# Altium project LTC_on_COMP.PrjPcb
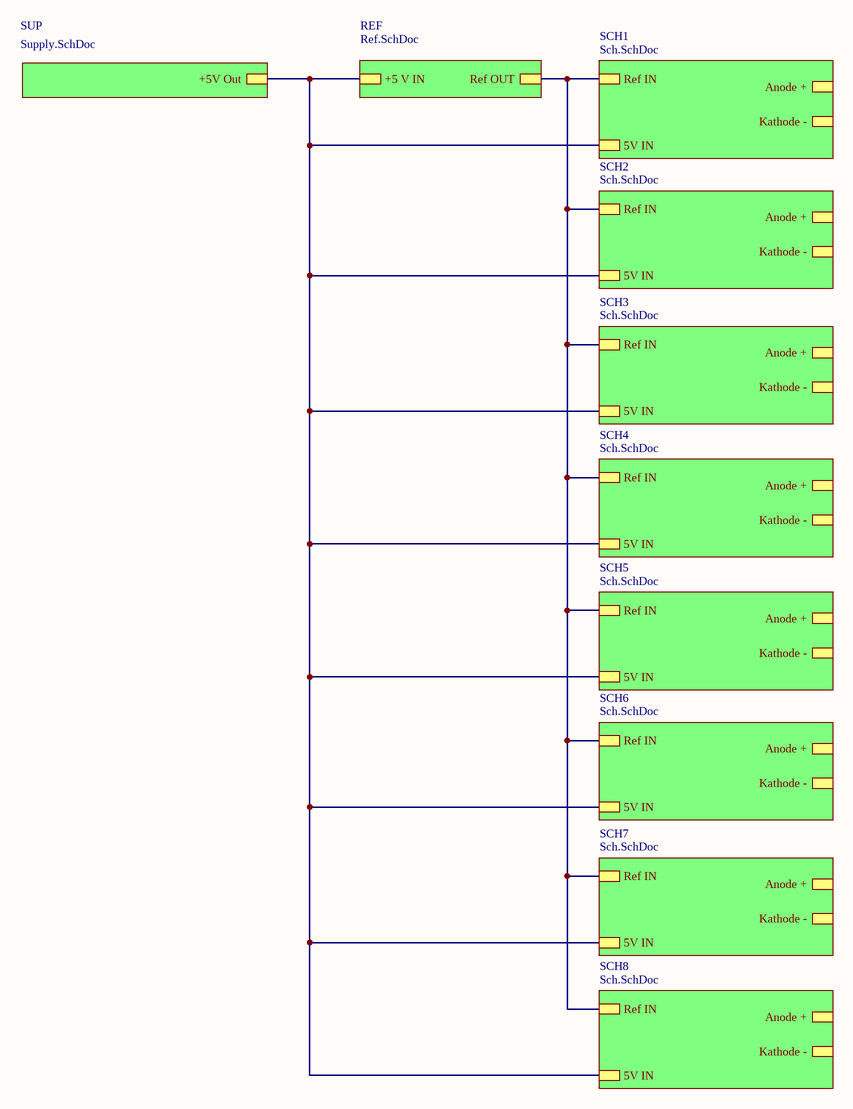
[diagram p0: Struct.SchDoc]
4 sheets, 77 parts. Net scope: hierarchical (ports join the sheet entries above them; power ports are global).
Board files: PCB1.PcbDoc, PCB2.PcbDoc
Sheets:
  Struct.SchDoc
    REF = Ref.SchDoc
    SUP = Supply.SchDoc
    SCH1 = Sch.SchDoc
    SCH2 = Sch.SchDoc
    SCH3 = Sch.SchDoc
    SCH4 = Sch.SchDoc
    SCH5 = Sch.SchDoc
    SCH6 = Sch.SchDoc
    SCH7 = Sch.SchDoc
    SCH8 = Sch.SchDoc

## Sheet Struct.SchDoc
size 420 x 297 mm; Address1: Address1; Address2: Address2; Address3: Address3; Address4: Address4; DocumentNumber: АБВГ.123456.001 Э3; SheetNumber: 1; Scale: 1:1; DocumentType: Схема электрическая принципиальная; FirstReferrence: АБВГ.123456.001

### Sub-sheets
REF = Ref.SchDoc: +5 V IN, Ref OUT
SCH1 = Sch.SchDoc: Ref IN, 5V IN, Anode +, Kathode -
SCH2 = Sch.SchDoc: Ref IN, 5V IN, Anode +, Kathode -
SCH3 = Sch.SchDoc: Ref IN, 5V IN, Anode +, Kathode -
SCH4 = Sch.SchDoc: Ref IN, 5V IN, Anode +, Kathode -
SCH5 = Sch.SchDoc: Ref IN, 5V IN, Anode +, Kathode -
SCH6 = Sch.SchDoc: Ref IN, 5V IN, Anode +, Kathode -
SCH7 = Sch.SchDoc: Ref IN, 5V IN, Anode +, Kathode -
SCH8 = Sch.SchDoc: Ref IN, 5V IN, Anode +, Kathode -
SUP = Supply.SchDoc: +5V Out

### Nets
NetC3#1_2: sheet REF/+5 V IN, sheet SUP/+5V Out, sheet SCH1/5V IN, sheet SCH2/5V IN, sheet SCH3/5V IN, sheet SCH4/5V IN, sheet SCH5/5V IN, sheet SCH6/5V IN, sheet SCH7/5V IN, sheet SCH8/5V IN
NetC3#2_2: sheet REF/Ref OUT, sheet SCH1/Ref IN, sheet SCH2/Ref IN, sheet SCH3/Ref IN, sheet SCH4/Ref IN, sheet SCH5/Ref IN, sheet SCH6/Ref IN, sheet SCH7/Ref IN, sheet SCH8/Ref IN

### Notes on the sheet
- Перв. примен.
- Справ. №
- Подп. и дата
- Инв. № дубл.
- Взам. инв. №
- Разраб.
- Изм.
- Лист
- № докум.
- Подп.
- Дата
- Лит.
- Масса
- Масштаб
- Пров.
- Т.контр.
- Листов
- Инв. № подл.
- Утв.
- Н.контр.
- 2.106-A3
- Копировал
- Формат А3

## Sheet Ref.SchDoc
size 420 x 297 mm; Address1: Address1; Address2: Address2; Address3: Address3; Address4: Address4; DocumentNumber: АБВГ.123456.001 Э3; SheetNumber: 1; Scale: 1:1; DocumentType: Схема электрическая принципиальная; FirstReferrence: АБВГ.123456.001
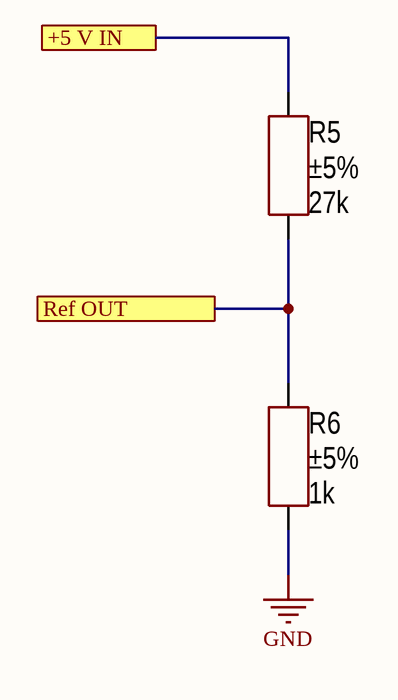
[diagram p1: Ref.SchDoc]

### Parts
(Parts that share a designator on the sheet are numbered #1, #2 ... from top to bottom, then left to right.)
R5#1  value 27k  Tolerance: ±5%  [RES: 0805]
R6#1  value 1k  Tolerance: ±5%  [RES: 0805]

### Ports
+5 V IN, Ref OUT

### Nets
GND: R6#1.1
NetC3#1_2: R5#1.2 ; port +5 V IN
NetC3#2_2: R5#1.1 R6#1.2 ; port Ref OUT

### Notes on the sheet
- Перв. примен.
- Справ. №
- Подп. и дата
- Инв. № дубл.
- Взам. инв. №
- Разраб.
- Изм.
- Лист
- № докум.
- Подп.
- Дата
- Лит.
- Масса
- Масштаб
- Пров.
- Т.контр.
- Листов
- Инв. № подл.
- Утв.
- Н.контр.
- 2.106-A3
- Копировал
- Формат А3

### Library data of the parts
R5#1 = Resistor_0805: Manufacturer: Yageo; PartNumber: RC0805JR-07100RL; ValueManufacturerPartNumber: Resistor film, 27k, ±5%, 0805, 0.125W, -55...+125°C; TypeResistor: Resistor film; Power: 0.125W; Package: 0805; HelpURL: https://www.digikey.com/product-detail/en/yageo/RC0805JR-07100RL/311-100ARCT-ND/731185; Temperature: -55...+125°C
R6#1 = Resistor_0805: Manufacturer: Yageo; PartNumber: RC0805JR-07100RL; ValueManufacturerPartNumber: Resistor film, 1k, ±5%, 0805, 0.125W, -55...+125°C; TypeResistor: Resistor film; Power: 0.125W; Package: 0805; HelpURL: https://www.digikey.com/product-detail/en/yageo/RC0805JR-07100RL/311-100ARCT-ND/731185; Temperature: -55...+125°C

## Sheet Supply.SchDoc
size 420 x 297 mm; Address1: Address1; Address2: Address2; Address3: Address3; Address4: Address4; DocumentNumber: АБВГ.123456.001 Э3; SheetNumber: 1; Scale: 1:1; DocumentType: Схема электрическая принципиальная; FirstReferrence: АБВГ.123456.001
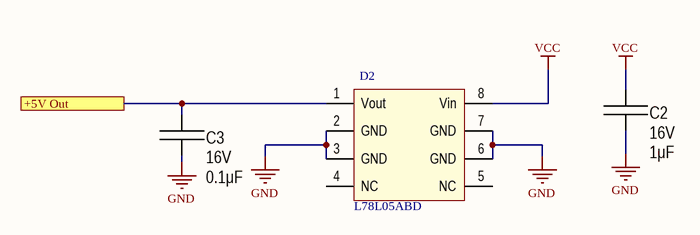
[diagram p2: Supply.SchDoc]

### Parts
(Parts that share a designator on the sheet are numbered #1, #2 ... from top to bottom, then left to right.)
C2  value 1μF  Voltage: 16V  [CAP: 0805]
C3#1  value 0.1μF  Voltage: 16V  [CAP: 0805]
D2#1  L78L05ABD  [8-SOIC]

### Ports
+5V Out

### Nets
GND: C2.1 C3#1.1 D2#1.2(GND) D2#1.3(GND) D2#1.6(GND) D2#1.7(GND)
VCC: C2.2 D2#1.8(Vin)
NetC3#1_2: C3#1.2 D2#1.1(Vout) ; port +5V Out

Not connected (* = marked no-connect by the designer): D2#1 4(NC) 5(NC)

### Notes on the sheet
- Перв. примен.
- Справ. №
- Подп. и дата
- Инв. № дубл.
- Взам. инв. №
- Разраб.
- Изм.
- Лист
- № докум.
- Подп.
- Дата
- Лит.
- Масса
- Масштаб
- Пров.
- Т.контр.
- Листов
- Инв. № подл.
- Утв.
- Н.контр.
- 2.106-A3
- Копировал
- Формат А3

### Library data of the parts
C2 = Ceramic_0805: Manufacturer: Yageo; PartNumber: CC0805KRX7R7BB104; ValueManufacturerPartNumber: Ceramic capacitor, 1μF, X7R, ±10%, 16V, 0805, -55...+125°C; TypeCapacitor: Ceramic capacitor; Tolerance: ±10%; TypeDielectric: X7R; Package: 0805; HelpURL: https://www.digikey.com/product-detail/en/yageo/CC0805KRX7R7BB104/311-1142-1-ND/303052; Temperature: -55...+125°C
C3#1 = Ceramic_0805: Manufacturer: Yageo; PartNumber: CC0805KRX7R7BB104; ValueManufacturerPartNumber: Ceramic capacitor, 0.1μF, X7R, ±10%, 16V, 0805, -55...+125°C; TypeCapacitor: Ceramic capacitor; Tolerance: ±10%; TypeDielectric: X7R; Package: 0805; HelpURL: https://www.digikey.com/product-detail/en/yageo/CC0805KRX7R7BB104/311-1142-1-ND/303052; Temperature: -55...+125°C

## Sheet Sch.SchDoc
size 420 x 297 mm; Address1: Address1; Address2: Address2; Address3: Address3; Address4: Address4; DocumentNumber: АБВГ.123456.001 Э3; SheetNumber: 1; Scale: 1:1; DocumentType: Схема электрическая принципиальная; FirstReferrence: АБВГ.123456.001
Used 8 times, as channels SCH1, SCH2, SCH3, SCH4, SCH5, SCH6, SCH7, SCH8. Parts and nets are listed once, with the designators drawn on the sheet.
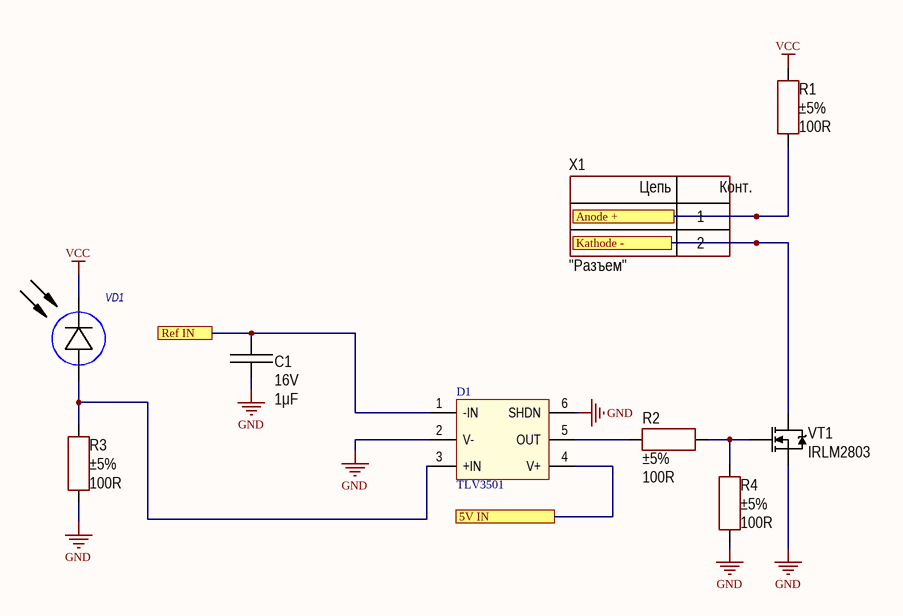
[diagram p3: Sch.SchDoc]

### Parts
C1  value 1μF  Voltage: 16V  [CAP: 0805]
D1  TLV3501  [SOT23-6]
R1  value 100R  Tolerance: ±5%  [RES: 1206]
R2  value 100R  Tolerance: ±5%  [RES: 0805]
R3  value 100R  Tolerance: ±5%  [RES: 0805]
R4  value 100R  Tolerance: ±5%  [RES: 0805]
VD1  SHF250  [LED: SFH757]  (value not drawn)
VT1  PartNumber: IRLM2803  [SOT23]
X1  CommentText: "Разъем"  [CON: KF301-5.0-2P]

### Ports
5V IN, Anode +, Kathode -, Ref IN

### Nets
GND: C1.1 D1.2(V-) D1.6(SHDN) R3.1 R4.1 VT1.2(S)
VCC: R1.2 VD1.2(C)
5V IN: D1.4(V+) ; port 5V IN
Anode +: R1.1 X1.1 ; port Anode +
Kathode -: VT1.3(D) X1.2 ; port Kathode -
Ref IN: C1.2 D1.1(-IN) ; port Ref IN
NetD1_3: D1.3(+IN) R3.2 VD1.1(A)
NetD1_5: D1.5(OUT) R2.1
NetR2_2: R2.2 R4.2 VT1.1(G)

### Channels
SCH1: designators C1=C3#2 D1=D2#2 R1=R3 R2=R4 R3=R5#2 R4=R6#2 VD1=VD1 VT1=VT1 X1=X2; ports 5V IN=NetC3#1_2 Anode +=NetR3_1 Kathode -=NetVT1_3 Ref IN=NetC3#2_2
SCH2: designators C1=C4 D1=D3 R1=R7 R2=R8 R3=R9 R4=R10 VD1=VD2 VT1=VT2 X1=X3; ports 5V IN=NetC3#1_2 Anode +=NetR7_1 Kathode -=NetVT2_3 Ref IN=NetC3#2_2
SCH3: designators C1=C5 D1=D4 R1=R11 R2=R12 R3=R13 R4=R14 VD1=VD3 VT1=VT3 X1=X4; ports 5V IN=NetC3#1_2 Anode +=NetR11_1 Kathode -=NetVT3_3 Ref IN=NetC3#2_2
SCH4: designators C1=C6 D1=D5 R1=R15 R2=R16 R3=R17 R4=R18 VD1=VD4 VT1=VT4 X1=X5; ports 5V IN=NetC3#1_2 Anode +=NetR15_1 Kathode -=NetVT4_3 Ref IN=NetC3#2_2
SCH5: designators C1=C7 D1=D6 R1=R19 R2=R20 R3=R21 R4=R22 VD1=VD5 VT1=VT5 X1=X6; ports 5V IN=NetC3#1_2 Anode +=NetR19_1 Kathode -=NetVT5_3 Ref IN=NetC3#2_2
SCH6: designators C1=C8 D1=D7 R1=R23 R2=R24 R3=R25 R4=R26 VD1=VD6 VT1=VT6 X1=X7; ports 5V IN=NetC3#1_2 Anode +=NetR23_1 Kathode -=NetVT6_3 Ref IN=NetC3#2_2
SCH7: designators C1=C9 D1=D8 R1=R27 R2=R28 R3=R29 R4=R30 VD1=VD7 VT1=VT7 X1=X8; ports 5V IN=NetC3#1_2 Anode +=NetR27_1 Kathode -=NetVT7_3 Ref IN=NetC3#2_2
SCH8: designators C1=C10 D1=D9 R1=R31 R2=R32 R3=R33 R4=R34 VD1=VD8 VT1=VT8 X1=X9; ports 5V IN=NetC3#1_2 Anode +=NetR31_1 Kathode -=NetVT8_3 Ref IN=NetC3#2_2

### Notes on the sheet
- Перв. примен.
- Справ. №
- Подп. и дата
- Инв. № дубл.
- Взам. инв. №
- Разраб.
- Изм.
- Лист
- № докум.
- Подп.
- Дата
- Лит.
- Масса
- Масштаб
- Пров.
- Т.контр.
- Листов
- Инв. № подл.
- Утв.
- Н.контр.
- 2.106-A3
- Копировал
- Формат А3
- (in symbol Connector_terminal_2pin) Цепь; Конт.

### Library data of the parts
C1 = Ceramic_0805: as C2 on sheet Supply; Package: 0805; HelpURL: https://www.digikey.com/product-detail/en/yageo/CC0805KRX7R7BB104/311-1142-1-ND/303052; Temperature: -55...+125°C
R1 = Resistor_1206: Manufacturer: Yageo; PartNumber: RC1206JR-07100RL; ValueManufacturerPartNumber: Resistor film, 100R, ±5%, 1206, 0.25W, -55...+125°C; TypeResistor: Resistor film; Power: 0.25W; Package: 1206; HelpURL: https://www.digikey.com/product-detail/en/yageo/RC1206JR-07100RL/311-100ERCT-ND/732153; Temperature: -55...+125°C
R2-R4 = Resistor_0805: Manufacturer: Yageo; PartNumber: RC0805JR-07100RL; ValueManufacturerPartNumber: Resistor film, 100R, ±5%, 0805, 0.125W, -55...+125°C; TypeResistor: Resistor film; Power: 0.125W; Package: 0805; HelpURL: https://www.digikey.com/product-detail/en/yageo/RC0805JR-07100RL/311-100ARCT-ND/731185; Temperature: -55...+125°C
VT1 = MOSFET_N_132: Manufacturer: Infineon Technologies; ValueManufacturerPartNumber: MOSFET N-channel transistor, 80V, 7A, 9.1nC, 2.5W, 34mOhm, 756pF, 8-TDSON, -55...+150°C; TypeTransistor: MOSFET N-channel transistor; VoltageDS: 80V; CurrentDS: 7A; RDS: 34mOhm; GateCharge: 9.1nC; InputCapacitor: 756pF; MaxPower: 2.5W; Package: 8-TDSON; HelpURL: https://www.digikey.com/product-detail/en/infineon-technologies/BSC340N08NS3GATMA1/BSC340N08NS3GATMA1TR-ND/2080655; Temperature: -55...+150°C
X1 = Connector_terminal_2pin: Manufacturer: Degson; ValueManufacturerPartNumber: Terminal connector, 2pin, 3.5mm, 300VAC, 10A; PartNumber: DG350-3.5-02P-14; TypeConnector: Terminal connector; VoltageMax: 300VAC; Pitch: 3.5mm; CurrentMax: 10A; Multichannel: 2pin; HelpURL: https://www.chipdip.ru/product/dg350-3.5-02p-12
VD1 = SHF250: Model: *; Manufacture: *; HelpURL: *; Case: *

## Nets that join several sheets
GND: Ref (R6#1.1), Supply (6 pins), SCH1 (6 pins), SCH2 (6 pins), SCH3 (6 pins), SCH4 (6 pins), SCH5 (6 pins), SCH6 (6 pins), SCH7 (6 pins), SCH8 (6 pins)
VCC: Supply (C2.2 D2#1.8), SCH1 (R3.2 VD1.2), SCH2 (R7.2 VD2.2), SCH3 (R11.2 VD3.2), SCH4 (R15.2 VD4.2), SCH5 (R19.2 VD5.2), SCH6 (R23.2 VD6.2), SCH7 (R27.2 VD7.2), SCH8 (R31.2 VD8.2)
NetC3#1_2: Ref (R5#1.2), Supply (C3#1.2 D2#1.1), SCH1 (D2#2.4), SCH2 (D3.4), SCH3 (D4.4), SCH4 (D5.4), SCH5 (D6.4), SCH6 (D7.4), SCH7 (D8.4), SCH8 (D9.4)
NetC3#2_2: Ref (R5#1.1 R6#1.2), SCH1 (C3#2.2 D2#2.1), SCH2 (C4.2 D3.1), SCH3 (C5.2 D4.1), SCH4 (C6.2 D5.1), SCH5 (C7.2 D6.1), SCH6 (C8.2 D7.1), SCH7 (C9.2 D8.1), SCH8 (C10.2 D9.1)